# Altium schematic sheet SoC.SchDoc
size C; DocumentNumber: 7; SheetNumber: 7; SheetTotal: 8
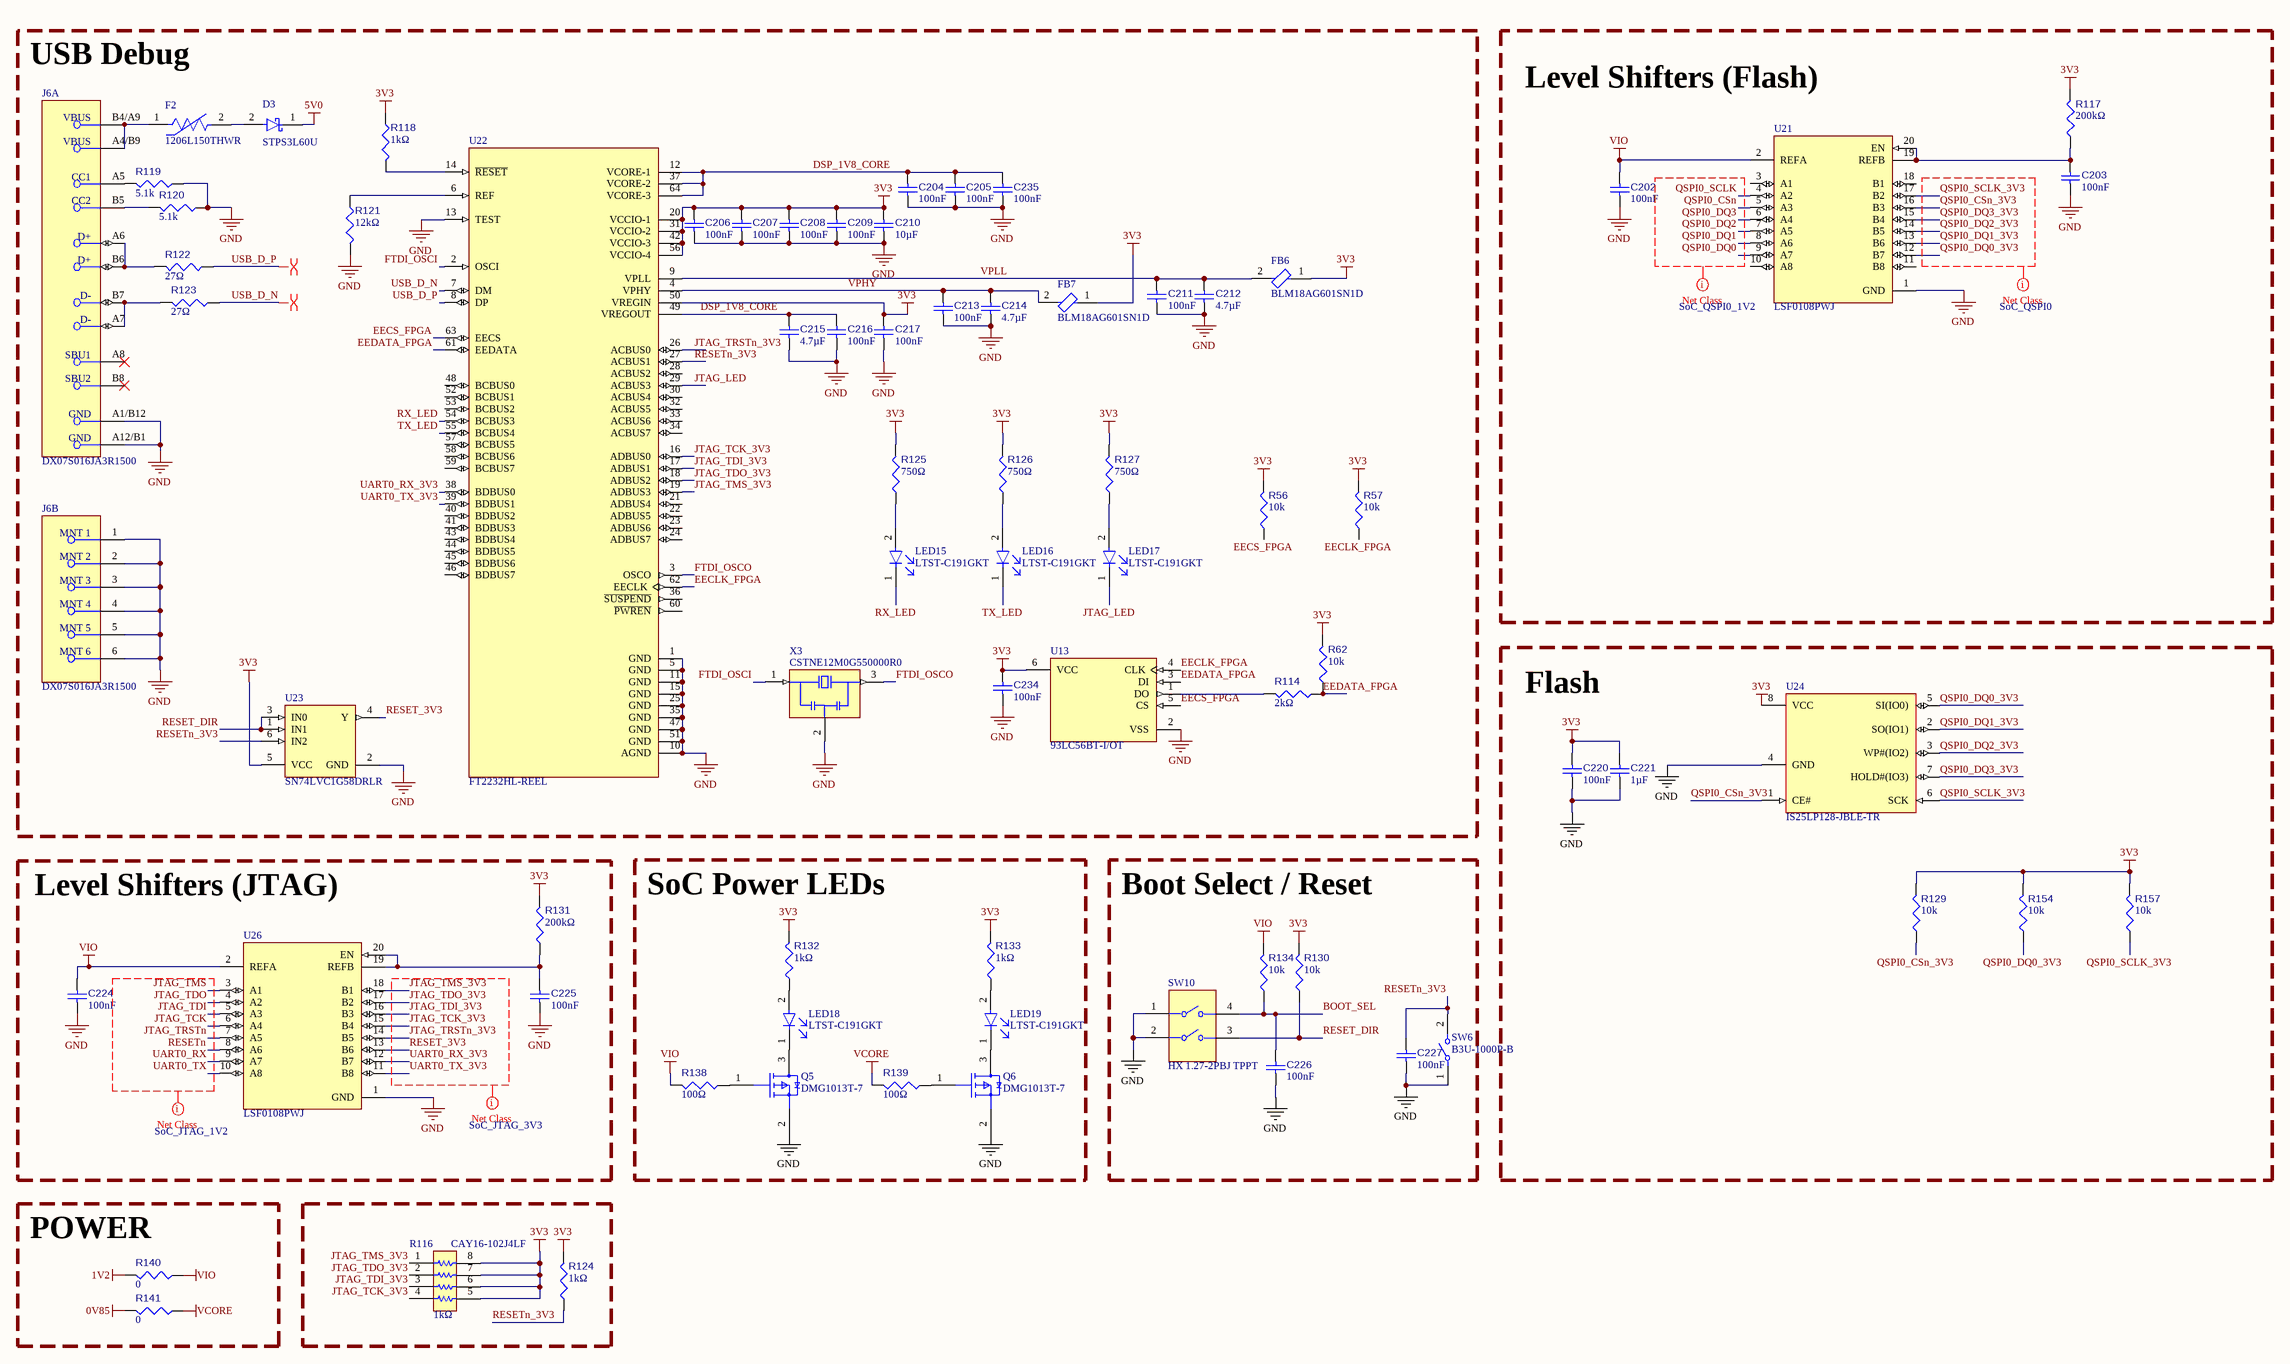
[diagram p0: SoC.SchDoc]

## Parts
C202  value 100nF  [CAP-0402-MFG]  (hidden comment: CL05B104KO5VPNC)
C203  value 100nF  [CAP-0402-MFG]  (hidden comment: CL05B104KO5VPNC)
C204  value 100nF  [CAP-0402-MFG]  (hidden comment: CL05B104KO5VPNC)
C205  value 100nF  [CAP-0402-MFG]  (hidden comment: CL05B104KO5VPNC)
C206  value 100nF  [CAP-0402-MFG]  (hidden comment: CL05B104KO5VPNC)
C207  value 100nF  [CAP-0402-MFG]  (hidden comment: CL05B104KO5VPNC)
C208  value 100nF  [CAP-0402-MFG]  (hidden comment: CL05B104KO5VPNC)
C209  value 100nF  [CAP-0402-MFG]  (hidden comment: CL05B104KO5VPNC)
C210  value 10µF  [CAP-0603-MFG]  (hidden comment: GRT188R61C106KE13J)
C211  value 100nF  [CAP-0402-MFG]  (hidden comment: CL05B104KO5VPNC)
C212  value 4.7µF  [CAP-0402-MFG]  (hidden comment: GRM155R61E475ME15D)
C213  value 100nF  [CAP-0402-MFG]  (hidden comment: CL05B104KO5VPNC)
C214  value 4.7µF  [CAP-0402-MFG]  (hidden comment: GRM155R61E475ME15D)
C215  value 4.7µF  [CAP-0402-MFG]  (hidden comment: GRM155R61E475ME15D)
C216  value 100nF  [CAP-0402-MFG]  (hidden comment: CL05B104KO5VPNC)
C217  value 100nF  [CAP-0402-MFG]  (hidden comment: CL05B104KO5VPNC)
C220  value 100nF  [CAP-0402-MFG]  (hidden comment: CL05B104KO5VPNC)
C221  value 1µF  [CAP-0402-MFG]  (hidden comment: GRT155C81C105KE13J)
C224  value 100nF  [CAP-0402-MFG]  (hidden comment: CL05B104KO5VPNC)
C225  value 100nF  [CAP-0402-MFG]  (hidden comment: CL05B104KO5VPNC)
C226  value 100nF  [CAP-0402-MFG]  (hidden comment: CL05B104KO5VPNC)
C227  value 100nF  [CAP-0402-MFG]  (hidden comment: CL05B104KO5VPNC)
C234  value 100nF  [CAP-0402-MFG]  (hidden comment: CL05B104KO5VPNC)
C235  value 100nF  [CAP-0402-MFG]  (hidden comment: CL05B104KO5VPNC)
D3  STPS3L60U  [FP-DO214AA-MFG]
F2  1206L150THWR  [FP-1206L050YR-MFG]
FB6  BLM18AG601SN1D  [FERRITEBEAD-0603-MFG]
FB7  BLM18AG601SN1D  [FERRITEBEAD-0603-MFG]
J6  DX07S016JA3R1500  [FP-DX07S016JA3R1500-MFG]  (parts A,B of 2)
LED15  LTST-C191GKT  [LED-0603-MFG]
LED16  LTST-C191GKT  [LED-0603-MFG]
LED17  LTST-C191GKT  [LED-0603-MFG]
LED18  LTST-C191GKT  [LED-0603-MFG]
LED19  LTST-C191GKT  [LED-0603-MFG]
Q5  DMG1013T-7  [FP-SOT523-MFG]
Q6  DMG1013T-7  [FP-SOT523-MFG]
R56  value 10k  [RES-0402]  (hidden comment: AC0402FR-0710KL)
R57  value 10k  [RES-0402]  (hidden comment: AC0402FR-0710KL)
R62  value 10k  [RES-0402]  (hidden comment: AC0402FR-0710KL)
R114  value 2kΩ  [RES-0402]  (hidden comment: AC0402FR-072KL)
R116  CAY16-102J4LF  value 1kΩ  [RES-4x0603-MFG]
R117  value 200kΩ  [RES-0402]  (hidden comment: AC0402FR-07200KL)
R118  value 1kΩ  [RES-0402]  (hidden comment: AC0402FR-071KL)
R119  value 5.1k  [RES-0402]  (hidden comment: AC0402FR-075K1L)
R120  value 5.1k  [RES-0402]  (hidden comment: AC0402FR-075K1L)
R121  value 12kΩ  [RES-0402]  (hidden comment: AC0402FR-0712KL)
R122  value 27Ω  [RES-0402]  (hidden comment: AC0402FR-0727RL)
R123  value 27Ω  [RES-0402]  (hidden comment: AC0402FR-0727RL)
R124  value 1kΩ  [RES-0402]  (hidden comment: AC0402FR-071KL)
R125  value 750Ω  [RES-0402]  (hidden comment: AC0402FR-07750RL)
R126  value 750Ω  [RES-0402]  (hidden comment: AC0402FR-07750RL)
R127  value 750Ω  [RES-0402]  (hidden comment: AC0402FR-07750RL)
R129  value 10k  [RES-0402]  (hidden comment: AC0402FR-0710KL)
R130  value 10k  [RES-0402]  (hidden comment: AC0402FR-0710KL)
R131  value 200kΩ  [RES-0402]  (hidden comment: AC0402FR-07200KL)
R132  value 1kΩ  [RES-0402]  (hidden comment: AC0402FR-071KL)
R133  value 1kΩ  [RES-0402]  (hidden comment: AC0402FR-071KL)
R134  value 10k  [RES-0402]  (hidden comment: AC0402FR-0710KL)
R138  value 100Ω  [RES-0402]  (hidden comment: AC0402FR-07100RL)
R139  value 100Ω  [RES-0402]  (hidden comment: AC0402FR-07100RL)
R140  value 0  [RES-0603-MFG]  (hidden comment: AC0603FR-070RL)
R141  value 0  [RES-0603-MFG]  (hidden comment: AC0603FR-070RL)
R154  value 10k  [RES-0402]  (hidden comment: AC0402FR-0710KL)
R157  value 10k  [RES-0402]  (hidden comment: AC0402FR-0710KL)
SW6  B3U-1000P-B  [FP-B3U-1000P-B-MFG]
SW10  HX 1.27-2PBJ TPPT  [HX 1.27-2PBJ TPPT-Footprint-1]
U13  93LC56BT-I/OT  [FP-SOT-23-6-MFG]
U21  LSF0108PWJ  [FP-TSSOP20-MFG]
U22  FT2232HL-REEL  [LQFP-64-MFG]
U23  SN74LVC1G58DRLR  [DRL0006A_M]
U24  IS25LP128-JBLE-TR  [FP-SOIC8-MFG]
U26  LSF0108PWJ  [FP-TSSOP20-MFG]
X3  CSTNE12M0G550000R0  [OSC-SMD3213-3P]

## Blocks framed on the sheet
USB Debug: C204-C217 C234 C235 D3 F2 FB6 FB7 J6 LED15-LED17 R56 R57 R62 R114 R118-R123 R125-R127 U13 U22 U23 X3
Level Shifters (Flash): C202 C203 R117 U21
Flash: C220 C221 R129 R154 R157 U24
Level Shifters (JTAG): C224 C225 R131 U26
SoC Power LEDs: LED18 LED19 Q5 Q6 R132 R133 R138 R139
Boot Select / Reset: C226 C227 R130 R134 SW6 SW10
POWER: R140 R141

## Nets
0V85: R141.2
1V2: R140.2
3V3: C206.1 C207.2 C208.1 C209.1 C210.1 C217.1 C220.1 C221.1 C234.2 FB6.1 FB7.1 R56.2 R57.2 R62.2 R116.5 R116.6 R116.7 R116.8 R117.2 R118.1 R124.2 R125.2 R126.2 R127.2 R129.2 R130.2 R131.2 R132.2 R133.2 R154.2 R157.2 U13.6(VCC) U22.20(VCCIO-1) U22.31(VCCIO-2) U22.42(VCCIO-3) U22.50(VREGIN) U22.56(VCCIO-4) U23.5(VCC) U24.8(VCC)
5V0: D3.1(K)
GND: C202.2 C203.2 C204.2 C205.2 C206.2 C207.1 C208.2 C209.2 C210.2 C211.2 C212.2 C213.2 C214.2 C215.2 C216.2 C217.2 C220.2 C221.2 C224.2 C225.2 C226.2 C227.2 C234.1 C235.2 J6.1(MNT_1) J6.2(MNT_2) J6.3(MNT_3) J6.4(MNT_4) J6.5(MNT_5) J6.6(MNT_6) J6.A1/B12(GND) J6.A12/B1(GND) Q5.2(S) Q6.2(S) R119.1 R120.1 R121.2 SW6.1 SW10.1 SW10.2 U13.2(VSS) U21.1(GND) U22.1(GND) U22.5(GND) U22.10(AGND) U22.11(GND) U22.13(TEST) U22.15(GND) U22.25(GND) U22.35(GND) U22.47(GND) U22.51(GND) U23.2(GND) U24.4(GND) U26.1(GND) X3.2(GND)
VCORE: R139.2 R141.1
VIO: C202.1 C224.1 R134.2 R138.2 R140.1 U21.2(REFA) U26.2(REFA)
BOOT_SEL: C226.1 R134.1 SW10.4
DSP_1V8_CORE: C204.1 C205.1 C215.1 C216.1 C235.1 U22.12(VCORE-1) U22.37(VCORE-2) U22.49(VREGOUT) U22.64(VCORE-3)
EECLK_FPGA: R57.1 U13.4(CLK) U22.62(EECLK)
EECS_FPGA: R56.1 U13.5(CS) U22.63(EECS)
EEDATA_FPGA: R62.1 R114.1 U13.3(DI) U22.61(EEDATA)
FTDI_OSCI: U22.2(OSCI) X3.1(IN)
FTDI_OSCO: U22.3(OSCO) X3.3(OUT)
JTAG_LED: LED17.1(C) U22.29(ACBUS3)
JTAG_TCK: U26.6(A4)
JTAG_TCK_3V3: R116.4 U22.16(ADBUS0) U26.15(B4)
JTAG_TDI: U26.5(A3)
JTAG_TDI_3V3: R116.3 U22.17(ADBUS1) U26.16(B3)
JTAG_TDO: U26.4(A2)
JTAG_TDO_3V3: R116.2 U22.18(ADBUS2) U26.17(B2)
JTAG_TMS: U26.3(A1)
JTAG_TMS_3V3: R116.1 U22.19(ADBUS3) U26.18(B1)
JTAG_TRSTn: U26.7(A5)
JTAG_TRSTn_3V3: U22.26(ACBUS0) U26.14(B5)
QSPI0_CSn: U21.5(A3)
QSPI0_CSn_3V3: R129.1 U21.16(B3) U24.1(CE#)
QSPI0_DQ0: U21.9(A7)
QSPI0_DQ0_3V3: R154.1 U21.12(B7) U24.5(SI(IO0))
QSPI0_DQ1: U21.8(A6)
QSPI0_DQ1_3V3: U21.13(B6) U24.2(SO(IO1))
QSPI0_DQ2: U21.7(A5)
QSPI0_DQ2_3V3: U21.14(B5) U24.3(WP#(IO2))
QSPI0_DQ3: U21.6(A4)
QSPI0_DQ3_3V3: U21.15(B4) U24.7(HOLD#(IO3))
QSPI0_SCLK: U21.4(A2)
QSPI0_SCLK_3V3: R157.1 U21.17(B2) U24.6(SCK)
RESET_3V3: U23.4(Y) U26.13(B6)
RESET_DIR: R130.1 SW10.3 U23.1(IN1) U23.3(IN0)
RESETn: U26.8(A6)
RESETn_3V3: C227.1 R124.1 SW6.2 U22.27(ACBUS1) U23.6(IN2)
RX_LED: LED15.1(C) U22.54(BCBUS3)
TX_LED: LED16.1(C) U22.55(BCBUS4)
UART0_RX: U26.9(A7)
UART0_RX_3V3: U22.38(BDBUS0) U26.12(B7)
UART0_TX: U26.10(A8)
UART0_TX_3V3: U22.39(BDBUS1) U26.11(B8)
USB_D_N: R123.1 U22.7(DM)
USB_D_P: R122.1 U22.8(DP)
VPHY: C213.1 C214.1 FB7.2 U22.4(VPHY)
VPLL: C211.1 C212.1 FB6.2 U22.9(VPLL)
NetC203_1: C203.1 R117.1 U21.19(REFB) U21.20(EN)
NetC225_1: C225.1 R131.1 U26.19(REFB) U26.20(EN)
NetD3_2: D3.2(A) F2.2
NetF2_1: F2.1 J6.A4/B9(VBUS) J6.B4/A9(VBUS)
NetJ6_A5: J6.A5(CC1) R119.2
NetJ6_A6: J6.A6(D+) J6.B6(D+) R122.2
NetJ6_A7: J6.A7(D-) J6.B7(D-) R123.2
NetJ6_B5: J6.B5(CC2) R120.2
NetLED15_2: LED15.2(A) R125.1
NetLED16_2: LED16.2(A) R126.1
NetLED17_2: LED17.2(A) R127.1
NetLED18_1: LED18.1(C) Q5.3(D)
NetLED18_2: LED18.2(A) R132.1
NetLED19_1: LED19.1(C) Q6.3(D)
NetLED19_2: LED19.2(A) R133.1
NetQ5_1: Q5.1(G) R138.1
NetQ6_1: Q6.1(G) R139.1
NetR114_2: R114.2 U13.1(DO)
NetR118_2: R118.2 U22.14(~{RESET})
NetR121_1: R121.1 U22.6(REF)

Not connected (* = marked no-connect by the designer): J6 A8(SBU1)* B8(SBU2)*; U21 3(A1) 10(A8) 11(B8) 18(B1); U22 21(ADBUS4) 22(ADBUS5) 23(ADBUS6) 24(ADBUS7) 28(ACBUS2) 30(ACBUS4) 32(ACBUS5) 33(ACBUS6) 34(ACBUS7) 36(~{SUSPEND}) 40(BDBUS2) 41(BDBUS3) 43(BDBUS4) 44(BDBUS5) 45(BDBUS6) 46(BDBUS7) 48(BCBUS0) 52(BCBUS1) 53(BCBUS2) 57(BCBUS5) 58(BCBUS6) 59(BCBUS7) 60(~{PWREN})

## Layout directives
differential pair: USB_D_N, USB_D_P
net class SoC_QSPI0: QSPI0_CSn_3V3, QSPI0_DQ0_3V3, QSPI0_DQ1_3V3, QSPI0_DQ2_3V3, QSPI0_DQ3_3V3, QSPI0_SCLK_3V3
net class SoC_QSPI0_1V2: QSPI0_CSn, QSPI0_DQ0, QSPI0_DQ1, QSPI0_DQ2, QSPI0_DQ3, QSPI0_SCLK
net class SoC_JTAG_3V3: JTAG_TCK_3V3, JTAG_TDI_3V3, JTAG_TDO_3V3, JTAG_TMS_3V3, JTAG_TRSTn_3V3, RESET_3V3, UART0_RX_3V3, UART0_TX_3V3
net class SoC_JTAG_1V2: JTAG_TCK, JTAG_TDI, JTAG_TDO, JTAG_TMS, JTAG_TRSTn, RESETn, UART0_RX, UART0_TX

## Library data of the parts
C202-C209 C211 C213 C216 C217 C220 C224-C227 C234 C235 = CMP-104-000086-6: 0402-100n-10%-16V-X7R-AECQ200; Manufacturer Name: Murata; Capacitor Type: Ceramic; Voltage Rating: 16V; Tolerance: 10%; Temp Code: X7R; Component Type: Standard; Min Operating Temperature: -55°C; Source: Components - 11.02.26 - 17.26.SchLib; Design Item ID: CMP-001-00111-7; Pin Count: 2; Max Operating Temperature: 125°C; Case/Package: 0402; Pins: 2; Info: 0402-100n-10%-16V-X7R-AECQ200; Manufacturer Part Number: CL05B104KO5VPNC; Mounting Technology: Surface Mount; JLC PN: C307332
C210 = CMP-104-000103-5: 0603-10u-10%-16V-X5R-AECQ200; Manufacturer Name: Murata; Tolerance: 10%; Voltage Rating: 16V; Capacitor Type: Ceramic; Design Item ID: CMP-001-00130-1; Min Operating Temperature: -55°C; Source: Components - 11.02.26 - 17.26.SchLib; Info: 0603-10u-10%-16V-X5R-AECQ200; Mounting Technology: Surface Mount; Pin Count: 2; Pins: 2; Manufacturer Part Number: GRT188R61C106KE13J; Max Operating Temperature: 85°C; Component Type: Standard; Case/Package: 0603; JLC PN: C3888097
C212 C214 C215 = CMP-104-000119-5: 0402-4.7u-20%-25V-X5R; Manufacturer Name: Murata; Temp Code: X5R; Tolerance: 20%; Capacitor Type: Ceramic; Voltage Rating: 25V; Pin Count: 2; Case/Package: 0402; Mounting Technology: Surface Mount; Source: Components - 11.02.26 - 17.26.SchLib; JLC PN: C2858031; Min Operating Temperature: -55°C; Max Operating Temperature: 85°C; Design Item ID: CMP-001-00116-4; Component Type: Standard; Info: 0402-4.7u-20%-25V-X5R; Pins: 2; Manufacturer Part Number: GRM155R61E475ME15D
C221 = CMP-104-000087-6: 0402-1u-10%-16V-X6S-AECQ200; Manufacturer Name: Murata; Temp Code: X6S; Voltage Rating: 16V; Capacitor Type: Ceramic; Tolerance: 10%; Min Operating Temperature: -55°C; Pin Count: 2; Design Item ID: CMP-001-00112-5; Manufacturer Part Number: GRT155C81C105KE13J; Info: 0402-1u-10%-16V-X6S-AECQ200; Mounting Technology: Surface Mount; Component Type: Standard; Case/Package: 0402; Source: Components - 11.02.26 - 17.26.SchLib; Max Operating Temperature: 105°C; Pins: 2; JLC PN: C908010
D3 = CMP-090-000051-3: DO214AA-UNI-SCHOTTKY-60V-3A-590mV; Manufacturer Name: STMicroelectronics; Forward Current: 3A; Max Reverse Leakage Current: 150µA; Forward Voltage: 590mV; Reverse Standoff Voltage: 60V; Min Operating Temperature: -65°C; Max Operating Temperature: 150°C; Info: DO214AA-UNI-SCHOTTKY-60V-3A-590mV; JLC PN: C132769; Case/Package: DO-214AA, SMB; Mounting Technology: Surface Mount; Manufacturer Part Number: STPS3L60U
F2 = CMP-008-000013-1: PTC Resettable Fuse 1.5A(hold) 3A(trip) 8VDC 100A 0.8W 0.3s 0.04Ohm SMD Solder Pad 1206 T/R; Manufacturer Name: Littelfuse; Power Dissipation: 800mW; Voltage Rating (DC): 8V; Time to Trip: 300ms; Approvals: TUV, cULus; Minimum Resistance Initial (Rmin): 40mΩ; Max Power Dissipation: 600mW; Value: 40mΩ; Maximum Resistance 1 Hour (R1max): 120mΩ; Max Operating Temperature: 85°C; Working Voltage: 8V; Number of Terminals: 2; Packaging: Cut Tape; Lifecycle Status: Production; Min Operating Temperature: -40°C; Height: 1mm; Hold Current: 1.5A; Operating Supply Voltage: 8V; Trip Current: 3A; Max Voltage Rating (DC): 8V; JLC PN: C118413; Current Rating: 100A; Width: 1.8mm; Case/Package: 1206; RoHS: Compliant; Voltage Rating: 8V; China RoHS: Compliant; Termination: SMD/SMT; Mounting Technology: Surface Mount; Case Code (Metric): 3216; Case Code (Imperial): 1206; Terminal Material: Copper; Lead Free: Lead Free; Manufacturer Part Number: 1206L150THWR; Ambient Temperature Range High: 85°C; REACH SVHC: Yes; Max Current Rating: 100A
FB6 FB7 = CMP-009-000012-2: Ferrite Beads Multi-Layer 600Ohm 25% 100MHz 500mA 380mOhm DCR 0603 Automotive Paper T/R; Manufacturer Name: Murata Electronics; Impedance: 600Ω; DC Resistance (DCR): 380mΩ; Frequency: 100MHz; JLC PN: C19330; Max Operating Temperature: 125°C; Current Rating: 500mA; Tolerance: 25%; Case/Package: 0603; Min Operating Temperature: -55°C; Manufacturer Part Number: BLM18AG601SN1D
J6 = CMP-055-000103-3: Receptacle, 16 Position, 1-Row SMT, without Rear Shield, Shell-DIP Length 1.2mm; Manufacturer Name: JAE Electronics; JLC PN: C3197625; Manufacturer Part Number: DX07S016JA3R1500
LED15-LED19 = CMP-132-000002-2: LED yellow green 0603 wavelength 569nm light intensity 12mcd Front Mounting; Manufacturer Name: Lite-On; Power Rating: 100mW; Viewing Angle: 130°; Forward Current: 30mA; Forward Voltage: 2.6V; Wavelength: 569nm; Pins: 2; Case/Package: 0603; Manufacturer Part Number: LTST-C191GKT; Min Operating Temperature: -55°C; Max Operating Temperature: 85°C; JLC PN: C99289; Mounting Technology: Surface Mount; Color: Green
Q5 Q6 = CMP-00055-3: P-Channel 20 V 0.7 Ohm 0.27 W Enhancement Mode Mosfet - SOT-523; Manufacturer Name: Diodes Inc; Power Dissipation: 270mW; Rds On Max: 700mΩ; Drain to Source Voltage (Vdss): -20V; Gate to Source Voltage (Vgs): 6V; Max Operating Temperature: 150°C; Min Operating Temperature: -55°C; Mounting Technology: Surface Mount; Max Power Dissipation: 270mW; Case/Package: SOT-523; Pins: 3; JLC PN: C96676; Manufacturer Part Number: DMG1013T-7
R56 R57 R62 R129 R130 R134 R154 R157 = CMP-014-000077-5: 0402-10k-1%-1/16W-AEC-Q200; Manufacturer Name: YAGEO; Tolerance: 1%; Voltage Rating: 50V; Power: 63mW; Pins: 2; Source: Components - 11.02.26 - 17.27.SchLib; Manufacturer Part Number: AC0402FR-0710KL; Info: 0402-10k-1%-1/16W-AEC-Q200; Min Operating Temperature: -55°C; Pin Count: 2; Case/Package: 0402; Design Item ID: CMP-009-00191-3; Max Operating Temperature: 155°C; Component Type: Standard; Mounting Technology: Surface Mount; JLC PN: C144807
R114 = CMP-014-000107-4: 0402-2k-1%-1/16W-AEC-Q200; Manufacturer Name: YAGEO; Voltage Rating: 50V; Tolerance: 1%; Power: 63mW; Max Operating Temperature: 155°C; Mounting Technology: Surface Mount; Case/Package: 0402; Component Type: Standard; Source: Components - 11.02.26 - 17.27.SchLib; Min Operating Temperature: -55°C; Info: 0402-2k-1%-1/16W-AEC-Q200; Design Item ID: CMP-009-00190-1; Pins: 2; Manufacturer Part Number: AC0402FR-072KL; Pin Count: 2; JLC PN: C144770
R116 = CMP-014-000102-1: Res Thick Film Array 1K Ohm 5% 0.25W(1/4W) ±200ppm/C ISOL 8-Pin 1206(4 X 0603) Convex SMD T/R; Manufacturer Name: Bourns; Number of Resistors: 4; Voltage Rating (DC): 50V; Power Dissipation: 250mW; Mounting Technology: Surface Mount; Tolerance: 5%; Manufacturer Part Number: CAY16-102J4LF; Min Operating Temperature: -55°C; JLC PN: C784824; Case/Package: 0603; Max Operating Temperature: 125°C; Pins: 8
R117 R131 = CMP-014-000126-4: 0402-200k-1%-1/16W-AEC-Q200; Manufacturer Name: YAGEO; Tolerance: 1%; Power: 63mW; Voltage Rating: 50V; Design Item ID: CMP-009-00210-1; Case/Package: 0402; Source: Components - 11.02.26 - 17.27.SchLib; Mounting Technology: Surface Mount; Min Operating Temperature: -55°C; Info: 0402-200k-1%-1/16W-AEC-Q200; Max Operating Temperature: 155°C; Pins: 2; Manufacturer Part Number: AC0402FR-07200KL; JLC PN: C144785
R118 R124 R132 R133 = CMP-014-000078-5: 0402-1k-1%-1/16W-AEC-Q200; Manufacturer Name: YAGEO; Voltage Rating: 50V; Power: 63mW; Tolerance: 1%; Manufacturer Part Number: AC0402FR-071KL; Pins: 2; Min Operating Temperature: -55°C; Max Operating Temperature: 155°C; Case/Package: 0402; Pin Count: 2; Source: Components - 11.02.26 - 17.27.SchLib; Mounting Technology: Surface Mount; Design Item ID: CMP-009-00192-1; Info: 0402-1k-1%-1/16W-AEC-Q200; Component Type: Standard; JLC PN: C144789
R119 R120 = CMP-014-000083-5: 0402-5.1k-1%-1/16W-AEC-Q200; Manufacturer Name: YAGEO; Tolerance: 1%; Voltage Rating: 50V; Power: 63mW; Source: Components - 11.02.26 - 17.27.SchLib; Max Operating Temperature: 155°C; Pins: 2; Manufacturer Part Number: AC0402FR-075K1L; Info: 0402-5.1k-1%-1/16W-AEC-Q200; Pin Count: 2; Mounting Technology: Surface Mount; Case/Package: 0402; Design Item ID: CMP-009-00197-1; Min Operating Temperature: -55°C; Component Type: Standard; JLC PN: C144745
R121 = CMP-014-000118-4: 0402-12k-1%-1/16W-AEC-Q200; Manufacturer Name: YAGEO; Voltage Rating: 50V; Power: 63mW; Tolerance: 1%; Source: Components - 11.02.26 - 17.27.SchLib; Info: 0402-12k-1%-1/16W-AEC-Q200; Min Operating Temperature: -55°C; Case/Package: 0402; Design Item ID: CMP-009-00210-1; Mounting Technology: Surface Mount; Pins: 2; Manufacturer Part Number: AC0402FR-0712KL; Max Operating Temperature: 155°C; JLC PN: C144798
R122 R123 = CMP-014-000120-4: 0402-27-1%-1/16W-AEC-Q200; Manufacturer Name: YAGEO; Tolerance: 1%; Voltage Rating: 50V; Power: 63mW; Mounting Technology: Surface Mount; Info: 0402-27-1%-1/16W-AEC-Q200; Pins: 2; Source: Components - 11.02.26 - 17.27.SchLib; Max Operating Temperature: 155°C; Manufacturer Part Number: AC0402FR-0727RL; Design Item ID: CMP-009-00210-1; Min Operating Temperature: -55°C; Case/Package: 0402; JLC PN: C226392
R125-R127 = CMP-014-000119-4: 0402-750-1%-1/16W-AEC-Q200; Manufacturer Name: YAGEO; Voltage Rating: 50V; Tolerance: 1%; Power: 63mW; Min Operating Temperature: -55°C; Pins: 2; Design Item ID: CMP-009-00210-1; Case/Package: 0402; Mounting Technology: Surface Mount; Source: Components - 11.02.26 - 17.27.SchLib; Info: 0402-750-1%-1/16W-AEC-Q200; Manufacturer Part Number: AC0402FR-07750RL; Max Operating Temperature: 155°C; JLC PN: C227221
R138 R139 = CMP-014-000108-4: 0402-100-1%-1/16W-AEC-Q200; Manufacturer Name: YAGEO; Voltage Rating: 50V; Power: 63mW; Tolerance: 1%; Case/Package: 0402; Manufacturer Part Number: AC0402FR-07100RL; Mounting Technology: Surface Mount; Pin Count: 2; Component Type: Standard; Max Operating Temperature: 155°C; Pins: 2; Design Item ID: CMP-009-00202-1; Min Operating Temperature: -55°C; Source: Components - 11.02.26 - 17.27.SchLib; Info: 0402-100-1%-1/16W-AEC-Q200; JLC PN: C144808
R140 R141 = CMP-014-000111-3: 0603-0-1A-AECQ200; Manufacturer Name: YAGEO; Voltage Rating: 75V; Tolerance: 1%; Mounting Technology: Surface Mount; JLC PN: C116699; Info: 0603-0-1A-AECQ200; Manufacturer Part Number: AC0603FR-070RL; Min Operating Temperature: -55°C; Max Operating Temperature: 155°C; Case/Package: 0603
SW6 = CMP-015-000062-1: Switch Tactile N.O. SPST Round Button Gull Wing 0.05A 12VDC 1.5N SMD Embossed T/R; Manufacturer Name: Omron; Contact Resistance: 100mΩ; Switch Function: Off-Mom; Max Current Rating: 50mA; Voltage Rating (DC): 12V; Manufacturer Part Number: B3U-1000P-B; Switch Type: SPST; Max Operating Temperature: 70°C; Mounting Technology: Surface Mount; JLC PN: C231329; Min Operating Temperature: -25°C
SW10 = CMP-051-000044-4: Dual 1.27mm SMT DIP Switch; Manufacturer Name: hanxia; JLC PN: C7430304; Manufacturer Part Number: HX 1.27-2PBJ TPPT
U13 = CMP-051-000048-2: Microwire Serial EEPROM Family, 2.5Vto 5.5V' 2 MHz, -40°Cto 125°C, SOT-23-6, RoHS; Manufacturer Name: Microchip; Max Supply Voltage: 5.5V; Interface: SPI; Min Supply Voltage: 2.5V; Memory Size: 256B; Height: 1.45mm; Min Operating Temperature: -40°C; Max Operating Temperature: 85°C; Case/Package: SOT-23; Memory Format: EEPROM; JLC PN: C190271; Mounting Technology: Surface Mount; Pins: 6; Manufacturer Part Number: 93LC56BT-I/OT
U21 U26 = CMP-051-000053-3: LSF0108 - 8-bit bidirectional multi-voltage level translator; open-drain; push-pull; Manufacturer Name: Nexperia; Operating Supply Current: 128mA; Number of Channels: 8; Min Supply Voltage: 950mV; Data Rate: 200Mbps; Max Supply Voltage: 5V; Topology: Open-Drain, Push-Pull; Pins: 20; Logic Function: Translator; Max Operating Temperature: 125°C; Min Operating Temperature: -40°C; Mounting Technology: Surface Mount; Channel Type: Bidirectional; JLC PN: C551522; Case/Package: TSSOP; Height: 1.1mm; Manufacturer Part Number: LSF0108PWJ
U22 = CMP-051-000002-4: USB Hi-Speed to Dual Channel Serial UART/FIFO/JTAG/SPI/I2C IC - LQFP-64; Manufacturer Name: FTDI; Operating Supply Current: 70mA; Data Rate: 60Mbps; Pin Count: 64; Source: FT2232HL-REEL.SchLib; Design Item ID: FT2232HL-REEL; Min Operating Temperature: -40°C; JLC PN: C27882; Case/Package: LQFP-64; Max Operating Temperature: 85°C; Manufacturer Part Number: FT2232HL-REEL
U23 = CMP-051-000052-2: Configurable Multiple-Function Gate 6-SOT-5X3 -40 to 125; Manufacturer Name: Texas Instruments; Logic Function: Multi Function; Max Supply Voltage: 5.5V; Min Supply Voltage: 1.65V; Number of Outputs: 1; Number of Inputs: 3; JLC PN: C2859828; Height: 600µm; Pins: 6; Mounting Technology: Surface Mount; Max Operating Temperature: 125°C; Min Operating Temperature: -40°C; Manufacturer Part Number: SN74LVC1G58DRLR
U24 = CMP-051-000050-3: NOR Flash Serial (SPI, Dual SPI, Quad SPI) 2.5V/3V/3.3V 128M-bit 16M x 8 8ns 8-Pin SOIC T/R; Manufacturer Name: ISSI; Min Supply Voltage: 2.3V; Max Supply Voltage: 3.6V; Type: Type; Pins: 8; Min Operating Temperature: -40°C; RefDes: RefDes; Case/Package: SOIC; Memory Format: FLASH; JLC PN: C521290; Copyright: Copyright (C) 2025 Ultra Librarian. All rights reserved.; Max Operating Temperature: 105°C; Design Item ID: IS25LP128-JBLE-TR; Source: IS25LP128-JBLE-TR.SchLib; Manufacturer Part Number: IS25LP128-JBLE-TR
X3 = CMP-005-000017-2: Ceramic Resonator 12MHz ±0.5% (Tol) ±0.2% (Stability) 33pF 30Ohm 3-Pin CSMD T/R; Manufacturer Name: Murata Electronics; ESR (Equivalent Series Resistance): 30Ω; Frequency Stability: 2000ppm; Mounting Technology: Surface Mount; Frequency: 12MHz; Load Capacitance: 33pF; Manufacturer Part Number: CSTNE12M0G550000R0; JLC PN: C341520; Max Operating Temperature: 85°C; Design Item ID: CSTNE12M0G550000R0; Frequency Tolerance: 0.5%; Min Operating Temperature: -40°C; Source: CSTNE12M0G550000R0.SchLib